# Altium schematic sheet Patient Protection.SchDoc: EEG Measurement Circuit
size A3; Date: 24/01/2025; DrawnBy: Giang Phan Truong; SheetNumber: 3; SheetTotal: 7
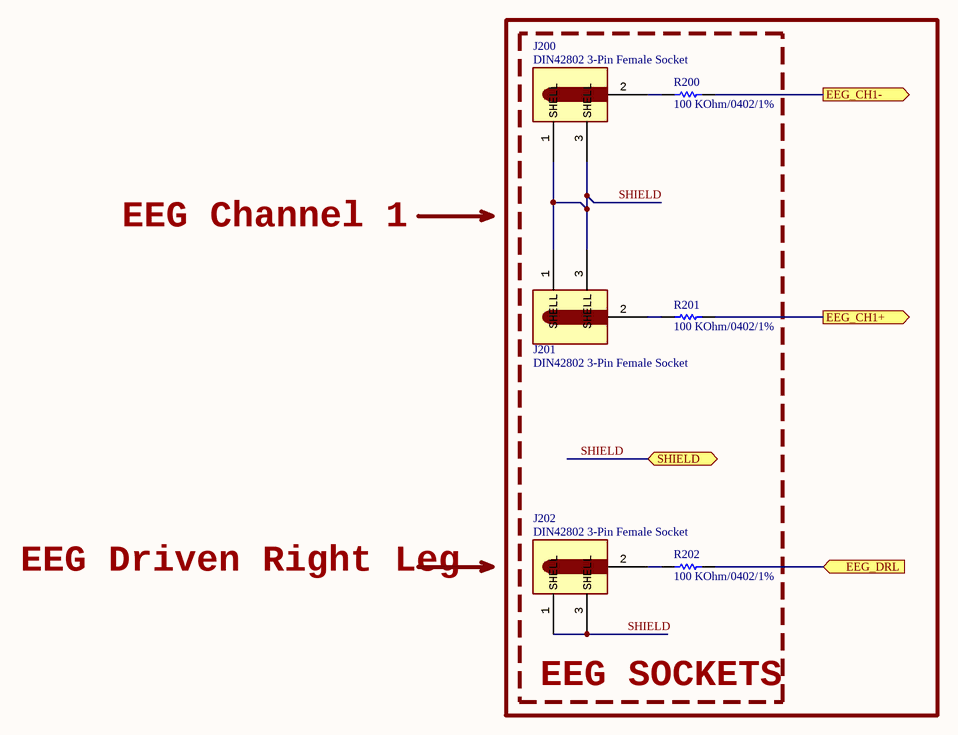
[diagram p0: Patient Protection.SchDoc]

## Parts
J200  value DIN42802 3-Pin Female Socket  [DIN42802-1.5MM SOCKET]  (hidden comment: DIN42802 1.5mm)
J201  value DIN42802 3-Pin Female Socket  [DIN42802-1.5MM SOCKET]  (hidden comment: DIN42802 1.5mm)
J202  value DIN42802 3-Pin Female Socket  [DIN42802-1.5MM SOCKET]  (hidden comment: DIN42802 1.5mm)
R200  value 100 KOhm/0402/1%  [R0402]  (hidden comment: Resistor 100 KOhm 0402 1%)
R201  value 100 KOhm/0402/1%  [R0402]  (hidden comment: Resistor 100 KOhm 0402 1%)
R202  value 100 KOhm/0402/1%  [R0402]  (hidden comment: Resistor 100 KOhm 0402 1%)

## Blocks framed on the sheet
EEG SOCKETS: J200-J202 R200-R202

## Ports
EEG_CH1+ (out, see Block Diagram[3B], EEG Preprocessing[1B]), EEG_CH1- (out, see Block Diagram[3B], EEG Preprocessing[1B]), EEG_DRL (in, see Block Diagram[3B], EEG Preprocessing[1D]), SHIELD (bidir, see Block Diagram[3B], EEG Preprocessing[2D])

## Nets
EEG_CH1+: R201.2 ; port EEG_CH1+
EEG_CH1-: R200.2 ; port EEG_CH1-
EEG_DRL: R202.2 ; port EEG_DRL
SHIELD: J200.1(SHELL) J200.3(SHELL) J201.1(SHELL) J201.3(SHELL) J202.1(SHELL) J202.3(SHELL) ; port SHIELD
NetJ200_2: J200.2(PORT) R200.1
NetJ201_2: J201.2(PORT) R201.1
NetJ202_2: J202.2(PORT) R202.1

## Notes on the sheet
- EEG Channel 1
- EEG Driven Right Leg
- Project Name:
- Size
- Size:
- A3
- Revision:
- Drawn By:
- Date:
- File:
- Last Modified:
- Checked By:
- Sheet
- of

## Library data of the parts
J200-J202 = DIN42802 1.5mm: 3 PIN Socket Female Socket for PCB EEG EMG DIN42802 1.5 mm Connector; ComponentLink1Description: Buy; ComponentLink1URL: https://www.alibaba.com/product-detail/3-PIN-Socket-Female-Socket-for_62497934533.html?chatToken=TDFKeWNGRlpkWFZTWmtkNFRYRnZjVWxhVTBsU2RVcHNkRVpKVTJsMlRteERiM0ZyWlhrM2VHMXhZeTkwTVVSb2RIQnFRMGxKTmtONE9GSllWWFFyVGtka2JsY3ZLMjB6UVdnMmRsaGxWbVZpU2xFNU5HeHRNWHBhVjJNdmFXcHlSelp0VHpKc01sVnFjMGRSYUZSbkwwRm9SM0ZJYjNSd1UxVTFORmszTUhKcGRERnVaVnBHVjJsaVQwdFRTRGx6WnpCcFVURnhXbWRsZHl0UU56bE5NRkJsVjBnelNXRjZibkJGUFE9PSZ2ZXJzaW9uPTIuMC4w&encryptTargetLoginId=8pctgRBMALPo2t4oyiyajgkFqFUijPBH6wdkfYSa%2Bs4%3D
R200-R202 = Resistor 100 KOhm 0402 1%: Code 104, 1/16W 1%; ComponentLink1Description: Buy; ComponentLink1URL: https://www.thegioiic.com/dien-tro-100-kohm-0402-1-